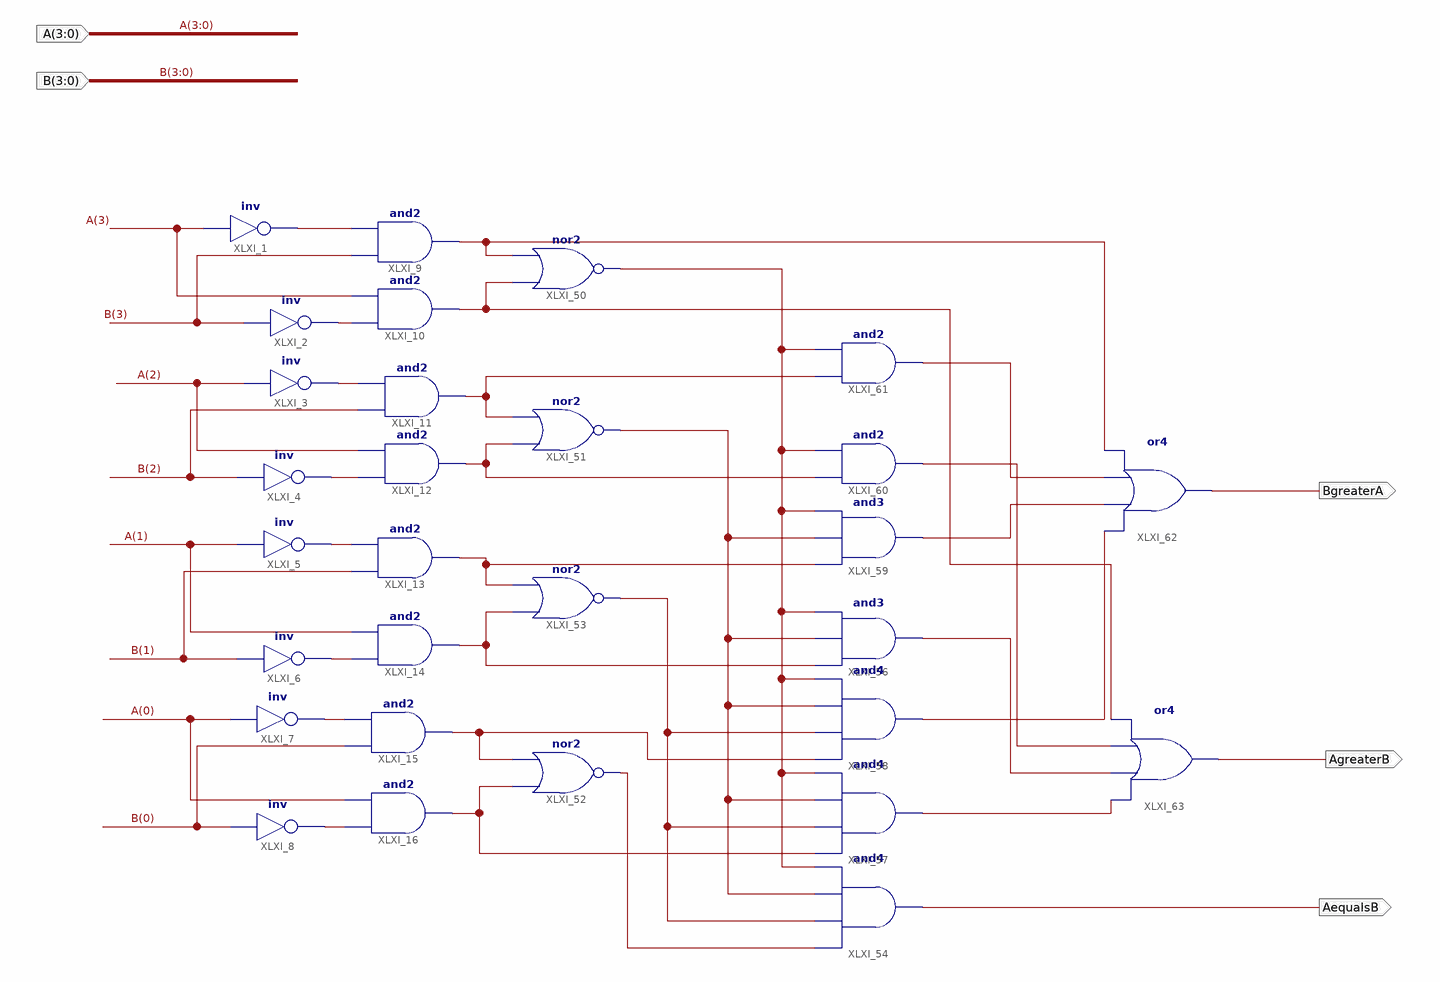
[diagram p0: schematic sheet 1]
// Xilinx ISE schematic four_bit_magnitude_comparator.sch (artix7) as structural Verilog: 29 symbols, 5 ports
module four_bit_magnitude_comparator (
  input  [3:0] A,
  input  [3:0] B,
  output AequalsB,
  output AgreaterB,
  output BgreaterA
);

  wire XLXN_11, XLXN_35, XLXN_36, XLXN_37, XLXN_38, XLXN_39, XLXN_40, XLXN_41, XLXN_48, XLXN_49, XLXN_51,
       XLXN_52, XLXN_53, XLXN_54, XLXN_55, XLXN_57, XLXN_58, XLXN_60, XLXN_61, XLXN_62, XLXN_63, XLXN_64,
       XLXN_65, XLXN_66, XLXN_67, XLXN_68;

  not XLXI_1 (XLXN_11, A[3]);
  and XLXI_10 (XLXN_49, XLXN_35, A[3]);
  and XLXI_16 (XLXN_55, XLXN_41, A[0]);
  and XLXI_15 (XLXN_54, B[0], XLXN_40);
  and XLXI_14 (XLXN_53, XLXN_39, A[1]);
  and XLXI_13 (XLXN_52, B[1], XLXN_38);
  and XLXI_12 (XLXN_51, XLXN_37, A[2]);
  and XLXI_11 (XLXN_58, B[2], XLXN_36);
  and XLXI_9 (XLXN_48, B[3], XLXN_11);
  not XLXI_2 (XLXN_35, B[3]);
  not XLXI_8 (XLXN_41, B[0]);
  not XLXI_7 (XLXN_40, A[0]);
  not XLXI_6 (XLXN_39, B[1]);
  not XLXI_5 (XLXN_38, A[1]);
  not XLXI_4 (XLXN_37, B[2]);
  not XLXI_3 (XLXN_36, A[2]);
  nor XLXI_50 (XLXN_57, XLXN_49, XLXN_48);
  nor XLXI_51 (XLXN_66, XLXN_51, XLXN_58);
  nor XLXI_52 (XLXN_67, XLXN_55, XLXN_54);
  nor XLXI_53 (XLXN_68, XLXN_53, XLXN_52);
  and XLXI_54 (AequalsB, XLXN_67, XLXN_68, XLXN_66, XLXN_57);
  and XLXI_56 (XLXN_63, XLXN_53, XLXN_66, XLXN_57);
  and XLXI_57 (XLXN_65, XLXN_55, XLXN_68, XLXN_66, XLXN_57);
  and XLXI_58 (XLXN_64, XLXN_54, XLXN_68, XLXN_66, XLXN_57);
  and XLXI_59 (XLXN_62, XLXN_52, XLXN_66, XLXN_57);
  and XLXI_60 (XLXN_61, XLXN_51, XLXN_57);
  and XLXI_61 (XLXN_60, XLXN_58, XLXN_57);
  or XLXI_62 (BgreaterA, XLXN_64, XLXN_62, XLXN_60, XLXN_48);
  or XLXI_63 (AgreaterB, XLXN_65, XLXN_63, XLXN_61, XLXN_49);
endmodule
